# Altium project EMS_Bus.PrjPcb
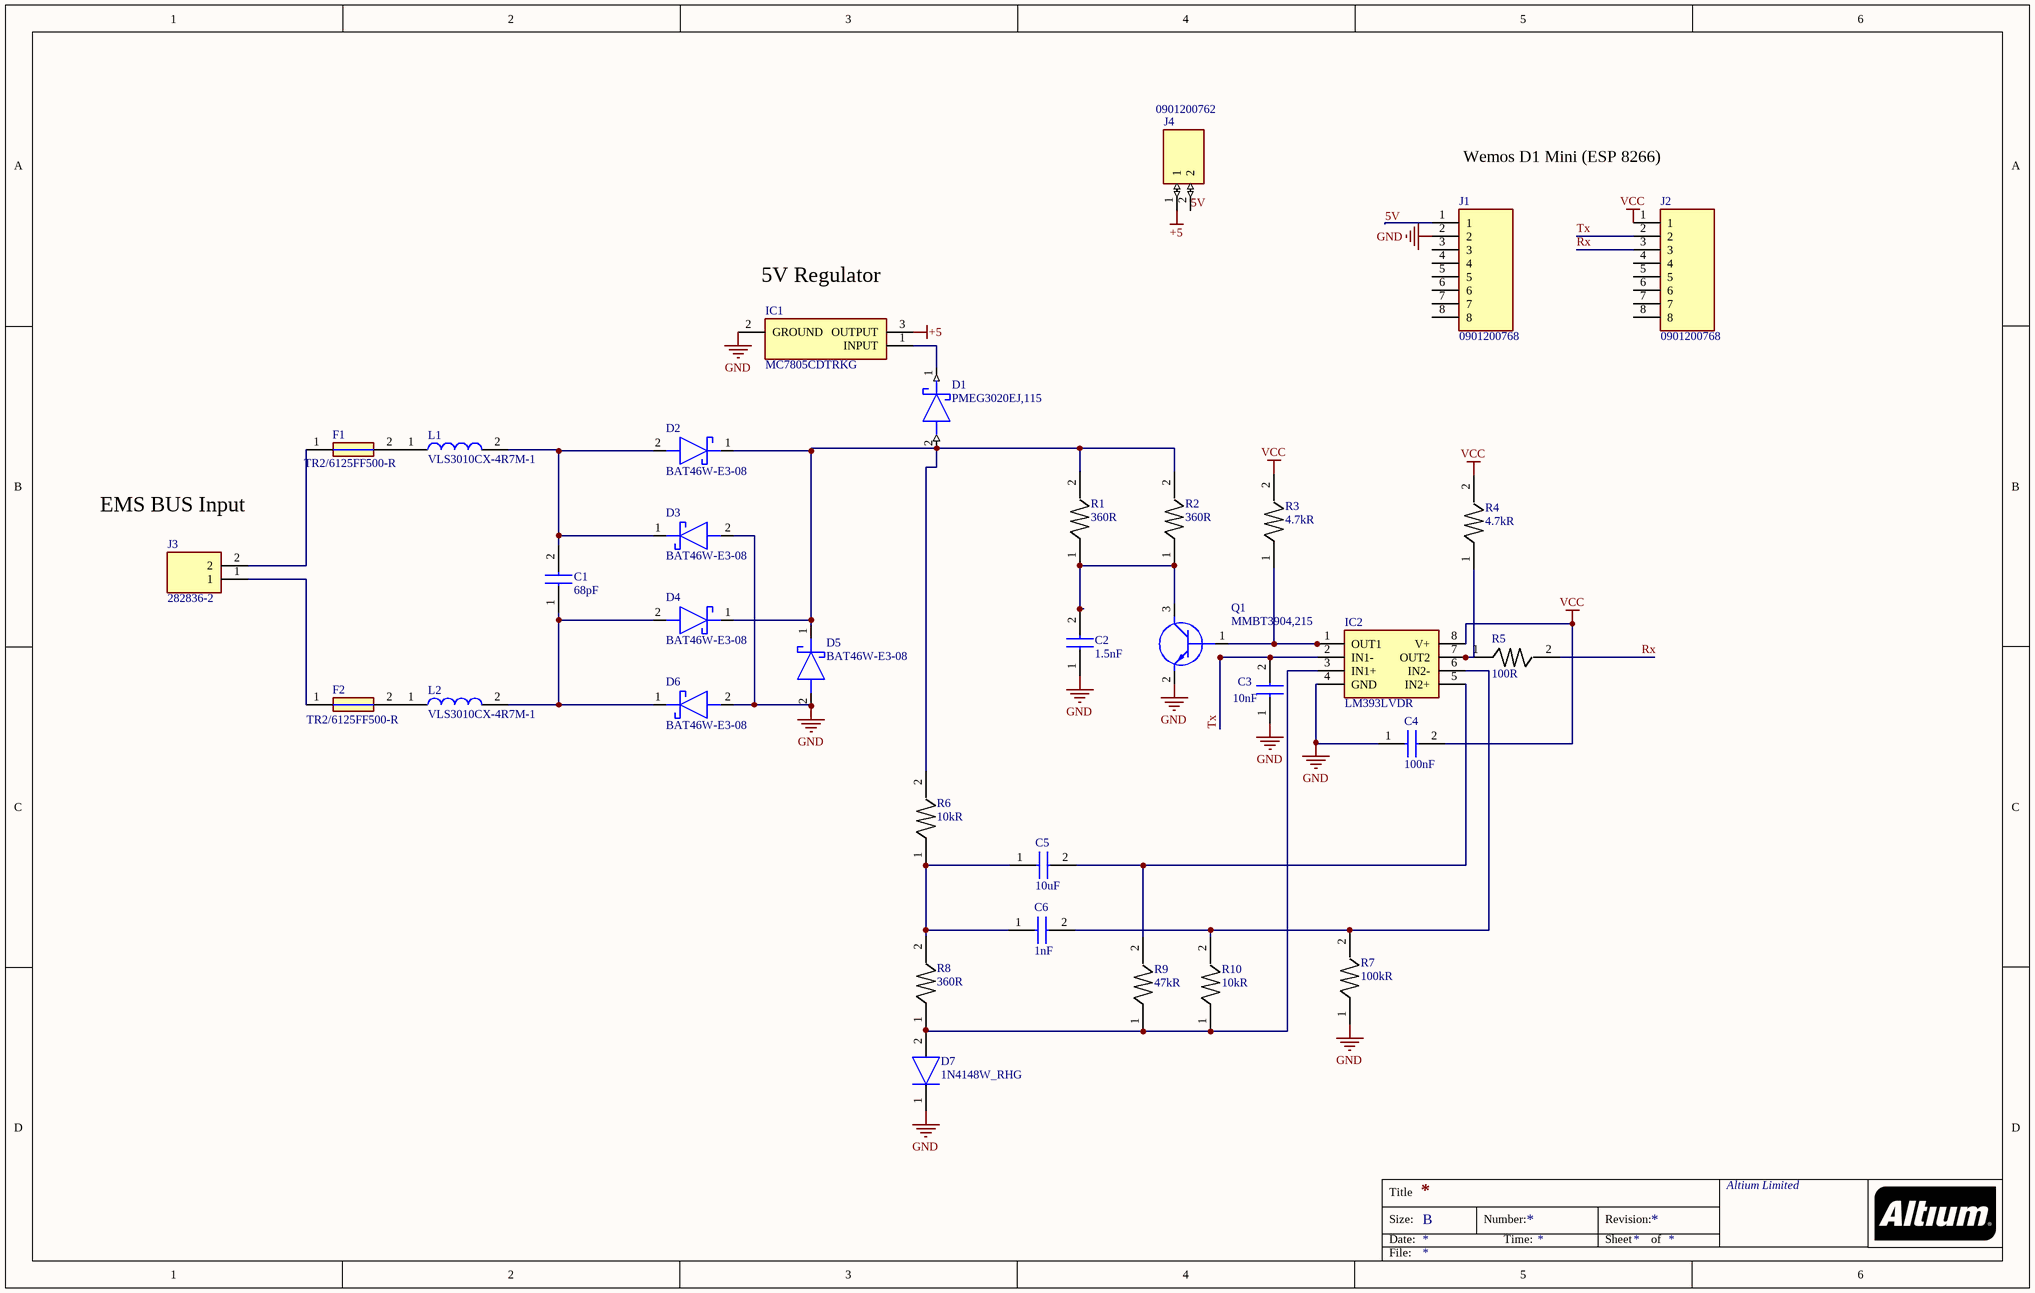
[diagram p0: EMS_Bus.SchDoc]
1 sheet, 34 parts. Net scope: global (net labels, ports and power ports of the same name join across sheets).
Board file: EMS_Bus.PcbDoc

## Sheet EMS_Bus.SchDoc
size B; Organization: Altium Limited; PageSetup: Record=PageOptions|CenterHorizontal=True|CenterVertical=True|PrintScale=1.09|XCorrection=1.00|YCorrection=1.00|PrintKind=0|BorderSize=5000000|LeftOffset=0|BottomOffset=0|Orientation=2|PaperLength=4318|PaperWidth=2794|Scale=100|PaperSource=7|PrintQuality=600|MediaType=1|DitherType=10|PaperKind=11" x 17"|PrintScaleMode=1

### Parts
C1  Capacitance: 68pF  [CAPC2012X70N]  (hidden comment: 885012007056)
C2  Capacitance: 1.5nF  [CAPC2012X90N]  (hidden comment: 885012207087)
C3  Capacitance: 10nF  [CAPC2012X90N]  (hidden comment: 885012207092)
C4  Capacitance: 100nF  [CAPC2012X90N]  (hidden comment: 885012207098)
C5  Capacitance: 10uF  [CAPC2012X135N]  (hidden comment: 885012107014)
C6  Capacitance: 1nF  [CAPC2012X90N]  (hidden comment: 885012007063)
D1  PMEG3020EJ,115  [SODFL2512X80N]
D2  BAT46W-E3-08  [SOD3716X135N]
D3  BAT46W-E3-08  [SOD3716X135N]
D4  BAT46W-E3-08  [SOD3716X135N]
D5  BAT46W-E3-08  [SOD3716X135N]
D6  BAT46W-E3-08  [SOD3716X135N]
D7  1N4148W_RHG  [1N4148WRHG]
F1  Manufacturer Part Number: TR2/6125FF500-R  [FUSC6127X287N]  (hidden comment: TR2_6125FF500-R)
F2  Manufacturer Part Number: TR2/6125FF500-R  [FUSC6127X287N]  (hidden comment: TR2_6125FF500-R)
IC1  MC7805CDTRKG  [MJD1221G]
IC2  LM393LVDR  [SOIC127P600X175-8N]
J1  0901200768  [HDRV8W65P0X254_1X8_2010X249X560P]
J2  0901200768  [HDRV8W65P0X254_1X8_2010X249X560P]
J3  282836-2  [2828362]
J4  0901200762  [HDRV2W65P0X254_1X2_508X254X925P]
L1  VLS3010CX-4R7M-1  [INDPM3030X100N]
L2  VLS3010CX-4R7M-1  [INDPM3030X100N]
Q1  MMBT3904,215  [SOT95P230X110-3N]
R1  Resistance: 360R  [RESC2012X60N]  (hidden comment: RC0805FR-07360RL)
R2  Resistance: 360R  [RESC2012X60N]  (hidden comment: RC0805FR-07360RL)
R3  Resistance: 4.7kR  [RESC2012X60N]  (hidden comment: RC0805FR-074K7L)
R4  Resistance: 4.7kR  [RESC2012X60N]  (hidden comment: RC0805FR-074K7L)
R5  Resistance: 100R  [RESC2012X60N]  (hidden comment: RC0805FR-07100RL)
R6  Resistance: 10kR  [RESC2012X60N]  (hidden comment: RT0805FRE0710KL)
R7  Resistance: 100kR  [RESC2012X60N]  (hidden comment: RC0805FR-07100KL)
R8  Resistance: 360R  [RESC2012X60N]  (hidden comment: RC0805FR-07360RL)
R9  Resistance: 47kR  [RESC2012X60N]  (hidden comment: RT0805FRE0747KL)
R10  Resistance: 10kR  [RESC2012X60N]  (hidden comment: RT0805FRE0710KL)

### Nets
+5: IC1.3(OUTPUT) J4.1
GND: C2.1 C3.1 C4.1 D3.2(A) D5.2(A) D6.2(A) D7.1(K) IC1.2(GROUND) IC2.4(GND) J1.2 Q1.2(E) R7.1
VCC: C4.2 IC2.8(V+) J2.1 R3.2 R4.2
5V: J1.1 J4.2
Rx: J2.3 R5.2
Tx: C3.2 IC2.2(IN1-) J2.2
NetC1_1: C1.1 D4.2(A) D6.1(K) L2.2
NetC1_2: C1.2 D2.2(A) D3.1(K) L1.2
NetC2_2: C2.2 Q1.3(C) R1.1 R2.1
NetC5_1: C5.1 C6.1 R6.1 R8.2
NetC5_2: C5.2 IC2.5(IN2+) R9.2
NetC6_2: C6.2 IC2.6(IN2-) R7.2 R10.2
NetD1_1: D1.1(K) IC1.1(INPUT)
NetD1_2: D1.2(A) D2.1(K) D4.1(K) D5.1(K) R1.2 R2.2 R6.2
NetD7_2: D7.2(A) IC2.3(IN1+) R8.1 R9.1 R10.1
NetF1_1: F1.1 J3.2
NetF1_2: F1.2 L1.1
NetF2_1: F2.1 J3.1
NetF2_2: F2.2 L2.1
NetIC2_1: IC2.1(OUT1) Q1.1(B) R3.1
NetIC2_7: IC2.7(OUT2) R4.1 R5.1

Not connected (* = marked no-connect by the designer): J1 3 4 5 6 7 8; J2 4 5 6 7 8

### Notes on the sheet
- Wemos D1 Mini (ESP 8266)
- (near IC1) 5V Regulator
- (near J3) EMS BUS Input
- Title
- Size:
- Date:
- B
- Number:
- Time:
- Revision:
- Sheet
- of
- File:

### Library data of the parts
C1 = 885012007056: Capacitor; Manufacturer_Name: Wurth Elektronik; Manufacturer: Wurth Electronics; Voltage Rating: 50V; Tolerance: 5%; Dielectric: X5R; Voltage Rating (DC): 16V; Datasheet Link: https://katalog.we-online.com/pbs/datasheet/885012007056.pdf; Height: 0.7mm; Manufacturer_Part_Number: 885012007056; Supplier 1: Digi-Key; Manufacturer Part Number: 885012007056; Stock 1: 6195; Pricing 1: 1=0.10000, 10=0.04900, 100=0.04410, 500=0.03900 (USD); RoHS: Yes; Mount: Surface Mount; Case/Package: 0805; Case Code (Metric): 2012; Case Code (Imperial): 0805; Min Operating Temperature: -55°C; Max Operating Temperature: 125°C; Packaging: Tape and Reel; Length: 0.079inch; Width: 0.049inch; Thickness: 0.028inch; RoHS Compliant: Yes; ComponentLink1URL: https://katalog.we-online.de/pbs/datasheet/885012007056.pdf?src-supplier=Digi-Key; ComponentLink1Description: https://katalog.we-online.de/pbs/datasheet/885012007056.pdf?src-supplier=Digi-Key; Supplier 2: Digi-Key; Stock 2: 4701; Pricing 2: 1=0.10000, 10=0.05900, 100=0.05310, 500=0.04698 (USD); ComponentLink2URL: https://katalog.we-online.de/pbs/datasheet/885012007063.pdf?src-supplier=Digi-Key; ComponentLink2Description: https://katalog.we-online.de/pbs/datasheet/885012007063.pdf?src-supplier=Digi-Key; Supplier 3: Digi-Key; Stock 3: 926; Pricing 3: 1=0.28000, 10=0.25600, 100=0.22990, 500=0.20334, 1000=0.13000 (USD); REACH SVHC: Unknown; ComponentLink3URL: http://www.farnell.com/datasheets/1958454.pdf?src-supplier=Farnell; ComponentLink3Description: http://www.farnell.com/datasheets/1958454.pdf?src-supplier=Farnell; ComponentLink4URL: http://www.farnell.com/datasheets/1958454.pdf?src-supplier=Element14; ComponentLink4Description: http://www.farnell.com/datasheets/1958454.pdf?src-supplier=Element14; ComponentLink5URL: https://katalog.we-online.de/pbs/datasheet/885012107014.pdf?src-supplier=Digi-Key; ComponentLink5Description: https://katalog.we-online.de/pbs/datasheet/885012107014.pdf?src-supplier=Digi-Key; ComponentLink6URL: http://www.farnell.com/datasheets/1958454.pdf?src-supplier=Newark; ComponentLink6Description: http://www.farnell.com/datasheets/1958454.pdf?src-supplier=Newark
C2 = 885012207087: Capacitor; Manufacturer_Name: Wurth Elektronik; Manufacturer: Wurth Electronics; Voltage Rating: 50V; Tolerance: 10%; Datasheet Link: https://katalog.we-online.com/pbs/datasheet/885012207087.pdf; Height: 0.9mm; Manufacturer_Part_Number: 885012207087; Mouser Part Number: 710-885012207087; Mouser Price/Stock: https://www.mouser.co.uk/ProductDetail/Wurth-Elektronik/885012207087/?qs=0KOYDY2FL29zqUuVSiTMTA%3D%3D; Supplier 1: Digi-Key; Manufacturer Part Number: 885012207087; Stock 1: 3440; Pricing 1: 1=0.10000, 10=0.03400, 100=0.03070, 500=0.02716 (USD); RoHS: Yes; Mount: Surface Mount; Case/Package: 0805; Case Code (Metric): 2012; Case Code (Imperial): 0805; Min Operating Temperature: -55°C; Max Operating Temperature: 125°C; Packaging: Tape and Reel; Length: 0.079inch; Width: 0.049inch; Thickness: 0.035inch; RoHS Compliant: Yes; ComponentLink1URL: https://katalog.we-online.de/pbs/datasheet/885012207087.pdf?src-supplier=Digi-Key; ComponentLink1Description: https://katalog.we-online.de/pbs/datasheet/885012207087.pdf?src-supplier=Digi-Key; Supplier Part Number 1: 732-8069-1-ND
C3 = 885012207092: Capacitor; Manufacturer_Name: Wurth Elektronik; Manufacturer: Wurth Electronics; Voltage Rating: 50V; Dielectric: X7R; Tolerance: 10%; Datasheet Link: https://katalog.we-online.com/pbs/datasheet/885012207092.pdf; Height: 0.9mm; Manufacturer_Part_Number: 885012207092; Mouser Part Number: 710-885012207092; Mouser Price/Stock: https://www.mouser.com/Search/Refine.aspx?Keyword=710-885012207092; Supplier 1: Digi-Key; Manufacturer Part Number: 885012207092; Stock 1: 15219; Pricing 1: 1=0.10000, 10=0.03400, 100=0.03070, 500=0.02714 (USD); RoHS: Yes; Mount: Surface Mount; Case/Package: 0805; Case Code (Metric): 2012; Case Code (Imperial): 0805; Min Operating Temperature: -55°C; Max Operating Temperature: 125°C; Packaging: Cut Tape; Voltage Rating (DC): 50V; Length: 0.079inch; Width: 0.049inch; Thickness: 0.035inch; REACH SVHC: Unknown; RoHS Compliant: Yes; ComponentLink1URL: http://www.farnell.com/datasheets/1958497.pdf?src-supplier=Farnell; ComponentLink1Description: http://www.farnell.com/datasheets/1958497.pdf?src-supplier=Farnell; ComponentLink2URL: http://www.farnell.com/datasheets/1958497.pdf?src-supplier=Newark; ComponentLink2Description: http://www.farnell.com/datasheets/1958497.pdf?src-supplier=Newark; ComponentLink3URL: https://katalog.we-online.de/pbs/datasheet/885012207092.pdf?src-supplier=Digi-Key; ComponentLink3Description: https://katalog.we-online.de/pbs/datasheet/885012207092.pdf?src-supplier=Digi-Key; ComponentLink4URL: http://www.farnell.com/datasheets/1958497.pdf?src-supplier=Element14; ComponentLink4Description: http://www.farnell.com/datasheets/1958497.pdf?src-supplier=Element14; Supplier Part Number 1: 732-8074-1-ND
C4 = 885012207098: Capacitor; Manufacturer_Name: Wurth Elektronik; Manufacturer: Wurth Electronics; Voltage Rating: 50V; Dielectric: X7R; Tolerance: 10%; Datasheet Link: https://katalog.we-online.com/pbs/datasheet/885012207098.pdf; Height: 0.9mm; Manufacturer_Part_Number: 885012207098; Mouser Part Number: 710-885012207098; Mouser Price/Stock: https://www.mouser.co.uk/ProductDetail/Wurth-Elektronik/885012207098?qs=0KOYDY2FL29sZCNyRsrK9g%3D%3D; Supplier 1: Digi-Key; Manufacturer Part Number: 885012207098; Stock 1: 65365; Pricing 1: 1=0.10000, 10=0.07400, 100=0.06640, 500=0.05878, 1000=0.03577 (USD); RoHS: Yes; Mount: Surface Mount; Case/Package: 0805; Case Code (Metric): 2012; Case Code (Imperial): 0805; Min Operating Temperature: -55°C; Max Operating Temperature: 125°C; Packaging: Cut Tape; Voltage Rating (DC): 50V; Length: 0.079inch; Width: 0.049inch; Thickness: 0.035inch; REACH SVHC: Unknown; RoHS Compliant: Yes; ComponentLink1URL: http://www.farnell.com/datasheets/1958498.pdf?src-supplier=Farnell; ComponentLink1Description: http://www.farnell.com/datasheets/1958498.pdf?src-supplier=Farnell; ComponentLink2URL: http://www.farnell.com/datasheets/1958498.pdf?src-supplier=Element14; ComponentLink2Description: http://www.farnell.com/datasheets/1958498.pdf?src-supplier=Element14; ComponentLink3URL: http://www.farnell.com/datasheets/1958498.pdf?src-supplier=Newark; ComponentLink3Description: http://www.farnell.com/datasheets/1958498.pdf?src-supplier=Newark; ComponentLink4URL: https://katalog.we-online.de/pbs/datasheet/885012207098.pdf?src-supplier=Digi-Key; ComponentLink4Description: https://katalog.we-online.de/pbs/datasheet/885012207098.pdf?src-supplier=Digi-Key; Supplier Part Number 1: 732-8080-1-ND
C5 = 885012107014: Capacitor; Manufacturer_Name: Wurth Elektronik; Manufacturer: Wurth Electronics; Voltage Rating: 16V; Dielectric: X5R; Tolerance: 20%; Datasheet Link: https://katalog.we-online.com/pbs/datasheet/885012107014.pdf; Height: 1.35mm; Manufacturer_Part_Number: 885012107014; Mouser Part Number: 710-885012107014; Mouser Price/Stock: https://www.mouser.co.uk/ProductDetail/Wurth-Elektronik/885012107014/?qs=0KOYDY2FL28i0pwNdARIlg%3D%3D; Supplier 1: Digi-Key; Manufacturer Part Number: 885012107014; Stock 1: 926; Pricing 1: 1=0.28000, 10=0.25600, 100=0.22990, 500=0.20334, 1000=0.13000 (USD); RoHS: Yes; Mount: Surface Mount; Case/Package: 0805; Case Code (Metric): 2012; Case Code (Imperial): 0805; Min Operating Temperature: -55°C; Max Operating Temperature: 85°C; Packaging: Cut Tape; Voltage Rating (DC): 16V; Length: 0.079inch; Width: 0.049inch; Thickness: 0.057inch; REACH SVHC: Unknown; RoHS Compliant: Yes; ComponentLink1URL: http://www.farnell.com/datasheets/1958454.pdf?src-supplier=Farnell; ComponentLink1Description: http://www.farnell.com/datasheets/1958454.pdf?src-supplier=Farnell; ComponentLink2URL: http://www.farnell.com/datasheets/1958454.pdf?src-supplier=Element14; ComponentLink2Description: http://www.farnell.com/datasheets/1958454.pdf?src-supplier=Element14; ComponentLink3URL: https://katalog.we-online.de/pbs/datasheet/885012107014.pdf?src-supplier=Digi-Key; ComponentLink3Description: https://katalog.we-online.de/pbs/datasheet/885012107014.pdf?src-supplier=Digi-Key; ComponentLink4URL: http://www.farnell.com/datasheets/1958454.pdf?src-supplier=Newark; ComponentLink4Description: http://www.farnell.com/datasheets/1958454.pdf?src-supplier=Newark; Supplier 2: Digi-Key; Stock 2: 926; Pricing 2: 1=0.28000, 10=0.25600, 100=0.22990, 500=0.20334, 1000=0.13000 (USD); Supplier 3: Mouser; Stock 3: 6658; Pricing 3: 1=0.29000, 10=0.25700, 50=0.25700, 100=0.23000, 1000=0.20400, 10000=0.17700 (USD)
C6 = 885012007063: Capacitor; Manufacturer_Name: Wurth Elektronik; Manufacturer: Wurth Electronics; Voltage Rating: 50V; Tolerance: 5%; Datasheet Link: https://katalog.we-online.com/pbs/datasheet/885012007063.pdf; Height: 0.9mm; Manufacturer_Part_Number: 885012007063; Mouser Part Number: 710-885012007063; Mouser Price/Stock: https://www.mouser.com/Search/Refine.aspx?Keyword=710-885012007063; Supplier 1: Digi-Key; Manufacturer Part Number: 885012007063; Stock 1: 4701; Pricing 1: 1=0.10000, 10=0.05900, 100=0.05310, 500=0.04698 (USD); RoHS: Yes; Mount: Surface Mount; Case/Package: 0805; Case Code (Metric): 2012; Case Code (Imperial): 0805; Min Operating Temperature: -55°C; Max Operating Temperature: 125°C; Packaging: Tape and Reel; Length: 0.079inch; Width: 0.049inch; Thickness: 0.035inch; RoHS Compliant: Yes; ComponentLink1URL: https://katalog.we-online.de/pbs/datasheet/885012007063.pdf?src-supplier=Digi-Key; ComponentLink1Description: https://katalog.we-online.de/pbs/datasheet/885012007063.pdf?src-supplier=Digi-Key; Supplier Part Number 1: 732-7858-1-ND
D1 = PMEG3020EJ,115: Schottky Diode; Manufacturer_Name: Nexperia; Datasheet Link: http://uk.rs-online.com/web/p/products/1242390; Height: 0.8mm; Manufacturer_Part_Number: PMEG3020EJ,115; Mouser Part Number: 771-PMEG3020EJ-T/R; Mouser Price/Stock: https://www.mouser.co.uk/ProductDetail/Nexperia/PMEG3020EJ115/?qs=LOCUfHb8d9uQQHu%2Fcy97QQ%3D%3D; Arrow Part Number: PMEG3020EJ,115; Arrow Price/Stock: https://www.arrow.com/en/products/pmeg3020ej115/nexperia
D2-D6 = BAT46W-E3-08: Schottky Diode; Manufacturer_Name: Vishay; Datasheet Link: https://www.vishay.com/docs/85663/bat46wv.pdf; Height: 1.35mm; Manufacturer_Part_Number: BAT46W-E3-08; Mouser Part Number: 78-BAT46W-E3-08; Mouser Price/Stock: https://www.mouser.co.uk/ProductDetail/Vishay-Semiconductors/BAT46W-E3-08/?qs=KP8Io%2FXyE5QAjvoG5XlHWA%3D%3D; Arrow Part Number: BAT46W-E3-08; Arrow Price/Stock: https://www.arrow.com/en/products/bat46w-e3-08/vishay; Supplier 1: Digi-Key; Supplier Part Number 1: BAT46W-E3-08CT-ND
D7 = 1N4148W_RHG: Diode; Manufacturer_Name: Taiwan Semiconductor; Manufacturer_Part_Number: 1N4148W RHG; Datasheet Link: https://mouser.componentsearchengine.com/Datasheets/1/1N4148W RHG.pdf; Height: 1.15mm; Mouser Part Number: 821-1N4148WRHG; Mouser Price/Stock: https://www.mouser.co.uk/ProductDetail/Taiwan-Semiconductor/1N4148W-RHG?qs=KwaGCOX4wIag2YPLXylAvA%3D%3D; Arrow Part Number: 1N4148W RHG; Arrow Price/Stock: https://www.arrow.com/en/products/1n4148wrhg/taiwan-semiconductor
F1 F2 = TR2_6125FF500-R: Fuse; Manufacturer_Name: Eaton; Manufacturer: Eaton Bussmann; Current Rating: 500mA; Max Voltage Rating (DC): 72V; Voltage Rating (AC): 125V; Resistance: 750mR; Fuse Type: Board Mount (Cartridge Style Excluded); Approvals: cULus; Datasheet Link: https://componentsearchengine.com/Datasheets/1/TR2_6125FF500-R.pdf; Height: 2.87mm; Manufacturer_Part_Number: TR2/6125FF500-R; Mouser Part Number: 504-TR2/6125FF500-R; Mouser Price/Stock: https://www.mouser.com/Search/Refine.aspx?Keyword=504-TR2%2F6125FF500-R; Supplier 1: Digi-Key; Stock 1: 4568; Pricing 1: 1=0.78000, 5=0.75800, 10=0.73400, 50=0.61740, 100=0.51260, 250=0.46600, 500=0.39610, 1000=0.34950 (USD); RoHS: Yes; Mount: Surface Mount; Case/Package: SMD/SMT; Number of Pins: 2; Weight: 0.032oz; Min Operating Temperature: -55°C; Voltage Rating (DC): 72V; Packaging: Tape and Reel; Package Quantity: 5000; Max Voltage Rating (AC): 125V; Fuse Current: 500mA; Series: 6125FF; DC Cold Resistance: 750mR; Length: 6.1mm; Width: 2.72mm; Depth: 2.72mm; Radiation Hardening: No; REACH SVHC: No SVHC; RoHS Compliant: Yes; ComponentLink1URL: https://datasheet.ciiva.com/8073/0851f98e-1dec-44f8-815f-387ec7fe1210-8073990.pdf?src-supplier=Element14; ComponentLink1Description: https://datasheet.ciiva.com/8073/0851f98e-1dec-44f8-815f-387ec7fe1210-8073990.pdf?src-supplier=Element14; Supplier Part Number 1: 283-2952-1-ND
IC1 = MC7805CDTRKG: Integrated Circuit; Manufacturer_Name: ON Semiconductor; Max Input Voltage: 35V; Min Input Voltage: 10V; Output Current: 1A; Nominal Output Voltage: 5V; Dropout Voltage: 2V; Number of Outputs: 1; Polarity: Positive; Quiescent Current: 3.2mA; Max Output Voltage: 5.2V; Output Voltage Accuracy: 4%; Power Supply Rejection Ratio (PSRR): 83dB; Output Type: Fixed; Datasheet Link: https://datasheet.lcsc.com/szlcsc/ON-Semicon-ON-MC7805CDTRKG_C54285.pdf; Height: 2.38mm; Manufacturer_Part_Number: MC7805CDTRKG; Mouser Part Number: 863-MC7805CDTRKG; Mouser Price/Stock: https://www.mouser.co.uk/ProductDetail/ON-Semiconductor/MC7805CDTRKG/?qs=%252B9%2Fcbd0IE0RZ%252B1%252BvH1A5MQ%3D%3D; Arrow Part Number: MC7805CDTRKG; Arrow Price/Stock: https://www.arrow.com/en/products/mc7805cdtrkg/on-semiconductor; Supplier 1: Digi-Key; Manufacturer: ON Semiconductor; Manufacturer Part Number: MC7805CDTRKG; Stock 1: 14176; Pricing 1: 1=0.56000, 10=0.47800, 25=0.44600, 100=0.33130, 250=0.28032, 500=0.26756, 1000=0.19749 (USD); RoHS: Yes; Mount: Surface Mount; Case/Package: DPAK; Number of Pins: 3; Contact Plating: Tin,Matte; Min Operating Temperature: 0°C; Max Operating Temperature: 125°C; Packaging: Tape and Reel; Package Quantity: 1; Max Output Current: 1A; Output Voltage: 5V; Number of Regulators: 1; Min Output Voltage: 5V; Accuracy: 4%; Length: 6.73mm; Width: 6.22mm; Radiation Hardening: No; REACH SVHC: No SVHC; Lead Free: Lead Free; Halogen Free: Halogen Free; RoHS Compliant: Yes; ComponentLink1URL: https://datasheet.ciiva.com/1643/mc7800-d-1643648.pdf?src-supplier=Newark; ComponentLink1Description: https://datasheet.ciiva.com/1643/mc7800-d-1643648.pdf?src-supplier=Newark; ComponentLink2URL: https://datasheet.ciiva.com/2042/mc7800-d-2042320.pdf?src-supplier=Digi-Key; ComponentLink2Description: https://datasheet.ciiva.com/2042/mc7800-d-2042320.pdf?src-supplier=Digi-Key; ComponentLink3URL: https://datasheet.ciiva.com/2042/mc7800-d-2042318.pdf?src-supplier=Digi-Key; ComponentLink3Description: https://datasheet.ciiva.com/2042/mc7800-d-2042318.pdf?src-supplier=Digi-Key; ComponentLink4URL: https://datasheet.ciiva.com/8229/mc7800-d-8229966.pdf?src-supplier=Avnet; ComponentLink4Description: https://datasheet.ciiva.com/8229/mc7800-d-8229966.pdf?src-supplier=Avnet; ComponentLink5URL: https://datasheet.ciiva.com/8234/mc7800-d-8234046.pdf?src-supplier=Avnet; ComponentLink5Description: https://datasheet.ciiva.com/8234/mc7800-d-8234046.pdf?src-supplier=Avnet; ComponentLink6URL: https://datasheet.ciiva.com/2042/mc7800-d-2042319.pdf?src-supplier=Digi-Key; ComponentLink6Description: https://datasheet.ciiva.com/2042/mc7800-d-2042319.pdf?src-supplier=Digi-Key; Supplier Part Number 1: MC7805CDTRKGOSCT-ND
IC2 = LM393LVDR: Integrated Circuit; Manufacturer_Name: Texas Instruments; Datasheet Link: https://www.ti.com/lit/ds/symlink/lm393lv.pdf?ts=1609509320428&ref_url=https%253A%252F%252Feu.mouser.com%252F; Height: 1.75mm; Manufacturer_Part_Number: LM393LVDR; Mouser Part Number: 595-LM393LVDR; Mouser Price/Stock: https://www.mouser.co.uk/ProductDetail/Texas-Instruments/LM393LVDR/?qs=zW32dvEIR3vk5%2FzEI25KTQ%3D%3D; Arrow Part Number: LM393LVDR; Arrow Price/Stock: https://www.arrow.com/en/products/lm393lvdr/texas-instruments; Supplier 1: Digi-Key; Manufacturer: Texas Instruments; Manufacturer Part Number: LM393LVDR; Stock 1: 1138; Pricing 1: 1=0.42000, 10=0.35800, 25=0.33400, 100=0.24800, 250=0.20988, 500=0.20034, 1000=0.14787 (USD); RoHS: No; Supplier Part Number 1: 296-LM393LVDRCT-ND
J1 J2 = 0901200768: Connector; Manufacturer_Name: Molex; Datasheet Link: https://www.molex.com/pdm_docs/sd/901200768_sd.pdf; Height: 5.6mm; Manufacturer_Part_Number: 0901200768; Arrow Part Number: 0901200768; Arrow Price/Stock: https://www.arrow.com/en/products/0901200768/molex
J3 = 282836-2: Connector; Manufacturer_Name: TE Connectivity; Datasheet Link: https://www.te.com/commerce/DocumentDelivery/DDEController?Action=showdoc&DocId=Customer+Drawing%7F282836%7FJ%7Fpdf%7FEnglish%7FENG_CD_282836_J.pdf%7F282836-2; Height: 10mm; Manufacturer_Part_Number: 282836-2; Mouser Part Number: 571-2828362; Mouser Price/Stock: https://www.mouser.co.uk/ProductDetail/TE-Connectivity/282836-2/?qs=A%252Bip%252BNCYi6Ohx9vaQ1l4dg%3D%3D; Arrow Part Number: 282836-2; Arrow Price/Stock: https://www.arrow.com/en/products/282836-2/te-connectivity
J4 = 0901200762: Connector; Manufacturer_Name: Molex; Datasheet Link: https://www.molex.com/pdm_docs/sd/901200761_sd.pdf; Height: 9.25mm; Manufacturer_Part_Number: 0901200762; Mouser Part Number: N/A; Mouser Price/Stock: https://www.mouser.com/Search/Refine.aspx?Keyword=N%2FA; Arrow Part Number: 0901200762; Arrow Price/Stock: https://www.arrow.com/en/products/0901200762/molex
L1 L2 = VLS3010CX-4R7M-1: Inductor; Manufacturer_Name: TDK; Datasheet Link: https://product.tdk.com/en/search/inductor/inductor/smd/info?part_no=VLS3010CX-2R2M-1; Height: 1mm; Manufacturer_Part_Number: VLS3010CX-4R7M-1; Mouser Part Number: 810-VLS3010CX-4R7M-1; Mouser Price/Stock: https://www.mouser.co.uk/ProductDetail/TDK/VLS3010CX-4R7M-1/?qs=B6kkDfuK7%2FBGNQNlQF7fxQ%3D%3D; Supplier 1: Digi-Key; Manufacturer: TDK; Manufacturer Part Number: VLS3010CX-4R7M-1; Stock 1: 0; RoHS: No; Supplier Part Number 1: 445-VLS3010CX-4R7M-1CT-ND
Q1 = MMBT3904,215: Transistor BJT NPN; Manufacturer_Name: Nexperia; Datasheet Link: http://assets.nexperia.com/documents/data-sheet/MMBT3904.pdf; Height: 1.1mm; Manufacturer_Part_Number: MMBT3904,215; Mouser Part Number: 771-MMBT3904T/R; Mouser Price/Stock: https://www.mouser.co.uk/ProductDetail/Nexperia/MMBT3904215/?qs=LOCUfHb8d9s%2FW6hzAJGDbw%3D%3D; Arrow Part Number: MMBT3904,215; Arrow Price/Stock: https://www.arrow.com/en/products/mmbt3904215/nexperia; Supplier 1: Digi-Key; Manufacturer: Nexperia; Manufacturer Part Number: MMBT3904,215; Stock 1: 211278; Pricing 1: 1=0.10000, 10=0.06500, 25=0.06200, 100=0.03500, 500=0.02750, 1000=0.01910 (USD); RoHS: Yes; RoHS Compliant: Yes; ComponentLink1URL: http://www.farnell.com/datasheets/2328888.pdf?src-supplier=Farnell; ComponentLink1Description: http://www.farnell.com/datasheets/2328888.pdf?src-supplier=Farnell; ComponentLink2URL: https://assets.nexperia.com/documents/data-sheet/MMBT3904.pdf?src-supplier=Digi-Key; ComponentLink2Description: https://assets.nexperia.com/documents/data-sheet/MMBT3904.pdf?src-supplier=Digi-Key; ComponentLink3URL: http://www.farnell.com/datasheets/2328888.pdf?src-supplier=Newark; ComponentLink3Description: http://www.farnell.com/datasheets/2328888.pdf?src-supplier=Newark; Supplier Part Number 1: 1727-4044-1-ND
R1 R2 R8 = RC0805FR-07360RL: Resistor; Manufacturer_Name: YAGEO (PHYCOMP); Manufacturer: Yageo; Tolerance: 1%; Power Rating: 125mW; Voltage Rating: 150V; Temperature Coefficient: 100ppm/°C; Datasheet Link: http://www.yageo.com/documents/recent/PYu-RC_Group_51_RoHS_L_10.pdf; Height: 0.6mm; Manufacturer_Part_Number: RC0805FR-07360RL; Mouser Part Number: 603-RC0805FR-07360RL; Mouser Price/Stock: https://www.mouser.co.uk/ProductDetail/Yageo/RC0805FR-07360RL?qs=g6xwsc4j%252B%2FrtiMosZ5jFWw%3D%3D; Supplier 1: Digi-Key; Manufacturer Part Number: RC0805FR-07360RL; Stock 1: 187; Pricing 1: 1=0.10000, 10=0.04000, 100=0.01620, 1000=0.00726, 2500=0.00630 (USD); RoHS: Yes; Mount: Surface Mount; Case/Package: 0805; Case Code (Imperial): 0805; Case Code (Metric): 2012; Size Code: 0805; Min Operating Temperature: -55°C; Max Operating Temperature: 155°C; Packaging: Tape and Reel; Termination: SMD/SMT; Voltage Rating (DC): 150V; Features: Moisture Resistant; Series: RC; Max Power Dissipation: 125mW; Number of Terminations: 2; Technology: THICK FILM; Length: 2mm; Depth: 1.25mm; Lead Free: Lead Free; RoHS Compliant: Yes; ComponentLink1URL: https://datasheet.ciiva.com/11808/0900766b8106beab-11808261.pdf?src-supplier=RSComponents; ComponentLink1Description: https://datasheet.ciiva.com/11808/0900766b8106beab-11808261.pdf?src-supplier=RSComponents; ComponentLink2URL: https://datasheet.ciiva.com/12667/rc0805-12667401.pdf?src-supplier=Mouser; ComponentLink2Description: https://datasheet.ciiva.com/12667/rc0805-12667401.pdf?src-supplier=Mouser; ComponentLink3URL: https://datasheet.ciiva.com/17423/rc0805-17423149.pdf?src-supplier=Future+Electronics; ComponentLink3Description: https://datasheet.ciiva.com/17423/rc0805-17423149.pdf?src-supplier=Future+Electronics; Supplier Part Number 1: 311-360CRCT-ND
R3 R4 = RC0805FR-074K7L: Resistor; Manufacturer_Name: YAGEO (PHYCOMP); Manufacturer: Yageo; Tolerance: 1%; Temperature Coefficient: 100ppm/°C; Voltage Rating (DC): 150V; Power Rating: 125mW; Datasheet Link: http://www.yageo.com/documents/recent/PYu-RC_Group_51_RoHS_L_10.pdf; Height: 0.6mm; Manufacturer_Part_Number: RC0805FR-074K7L; Mouser Part Number: 603-RC0805FR-074K7L; Mouser Price/Stock: https://www.mouser.co.uk/ProductDetail/Yageo/RC0805FR-074K7L?qs=VLOqbHBAO5cYXbrd7RTmuQ%3D%3D; Arrow Part Number: RC0805FR-074K7L; Arrow Price/Stock: https://www.arrow.com/en/products/rc0805fr-074k7l/yageo; Supplier 1: Digi-Key; Manufacturer Part Number: RC0805FR-074K7L; Stock 1: 978989; Pricing 1: 1=0.10000, 10=0.04000, 100=0.01620, 1000=0.00726, 2500=0.00630 (USD); RoHS: Yes; Case/Package: 0805; Number of Pins: 2; Case Code (Metric): 2012; Case Code (Imperial): 0805; Size Code: 0805; Min Operating Temperature: -55°C; Max Operating Temperature: 155°C; Resistor Type: Thick Film; Packaging: Tape and Reel; Package Quantity: 5000; Voltage Rating: 150V; Number of Terminations: 2; Termination: SMD/SMT; Max Power Dissipation: 125mW; Features: Moisture Resistant; Series: RC; Resistance Tolerance: 1%; Technology: THICK FILM; Construction: Rectangular; Length: 0.079inch; Width: 0.049inch; Depth: 1.25mm; REACH SVHC: No SVHC; Lead Free: Lead Free; RoHS Compliant: Yes; Military Standard: Not; ComponentLink1URL: https://datasheet.ciiva.com/11808/0900766b8106beab-11808155.pdf?src-supplier=RSComponents; ComponentLink1Description: https://datasheet.ciiva.com/11808/0900766b8106beab-11808155.pdf?src-supplier=RSComponents; ComponentLink2URL: https://datasheet.ciiva.com/7941/444164-7941804.pdf?src-supplier=Element14; ComponentLink2Description: https://datasheet.ciiva.com/7941/444164-7941804.pdf?src-supplier=Element14; ComponentLink3URL: https://datasheet.ciiva.com/7941/1686128-7941805.pdf?src-supplier=Element14; ComponentLink3Description: https://datasheet.ciiva.com/7941/1686128-7941805.pdf?src-supplier=Element14; ComponentLink4URL: https://datasheet.ciiva.com/7941/444164-7941806.pdf?src-supplier=Element14; ComponentLink4Description: https://datasheet.ciiva.com/7941/444164-7941806.pdf?src-supplier=Element14; ComponentLink5URL: https://datasheet.ciiva.com/6547/pyu-r-int-thick-7-6547263.pdf?src-supplier=Digi-Key; ComponentLink5Description: https://datasheet.ciiva.com/6547/pyu-r-int-thick-7-6547263.pdf?src-supplier=Digi-Key; ComponentLink6URL: https://datasheet.ciiva.com/46447/444164-46447583.pdf?src-supplier=Element14; ComponentLink6Description: https://datasheet.ciiva.com/46447/444164-46447583.pdf?src-supplier=Element14; Supplier Part Number 1: 311-4.70KCRCT-ND
R5 = RC0805FR-07100RL: Resistor; Manufacturer_Name: YAGEO (PHYCOMP); Manufacturer: Yageo; Tolerance: 1%; Temperature Coefficient: 100ppm/°C; Voltage Rating (DC): 150V; Power Rating: 125mW; Application(s): HIGH RELIABILITY; Datasheet Link: http://www.yageo.com/documents/recent/PYu-RC_Group_51_RoHS_L_10.pdf; Height: 0.6mm; Manufacturer_Part_Number: RC0805FR-07100RL; Mouser Part Number: 603-RC0805FR-07100RL; Mouser Price/Stock: https://www.mouser.co.uk/ProductDetail/Yageo/RC0805FR-07100RL?qs=8Y8p%252BasKcI6MtXUgG4E6SQ%3D%3D; Arrow Part Number: RC0805FR-07100RL; Arrow Price/Stock: https://www.arrow.com/en/products/rc0805fr-07100rl/yageo; Supplier 1: Digi-Key; Manufacturer Part Number: RC0805FR-07100RL; Stock 1: 3240557; Pricing 1: 1=0.10000, 10=0.04000, 100=0.01620, 1000=0.00726, 2500=0.00630 (USD); RoHS: Yes; Case/Package: 0805; Number of Pins: 2; Case Code (Imperial): 0805; Case Code (Metric): 2012; Weight: 0.000917oz; Min Operating Temperature: -55°C; Max Operating Temperature: 155°C; Resistor Type: Thick Film; Packaging: Cut Tape; Voltage Rating: 150V; Package Quantity: 5000; Termination: SMD/SMT; Number of Terminations: 2; Max Power Dissipation: 125mW; Features: Moisture Resistant; Type: General Purpose; Series: RC; Technology: THICK FILM; Length: 2mm; Width: 1.25mm; Depth: 1.25mm; Lead Pitch: 0.4mm; REACH SVHC: Unknown; Lead Free: Lead Free; Military Standard: Not; RoHS Compliant: Yes; ComponentLink1URL: https://datasheet.ciiva.com/7941/1697719-7941680.pdf?src-supplier=Element14; ComponentLink1Description: https://datasheet.ciiva.com/7941/1697719-7941680.pdf?src-supplier=Element14; ComponentLink2URL: https://datasheet.ciiva.com/11808/0900766b8106beab-11808877.pdf?src-supplier=RSComponents; ComponentLink2Description: https://datasheet.ciiva.com/11808/0900766b8106beab-11808877.pdf?src-supplier=RSComponents; ComponentLink3URL: https://datasheet.ciiva.com/17082/rc0805-17082697.pdf?src-supplier=Future+Electronics; ComponentLink3Description: https://datasheet.ciiva.com/17082/rc0805-17082697.pdf?src-supplier=Future+Electronics; ComponentLink4URL: https://datasheet.ciiva.com/2456/pyu-r-int-thick-7-2456989.pdf?src-supplier=Digi-Key; ComponentLink4Description: https://datasheet.ciiva.com/2456/pyu-r-int-thick-7-2456989.pdf?src-supplier=Digi-Key; ComponentLink5URL: https://datasheet.ciiva.com/7660/38627-7660797.pdf?src-supplier=Element14; ComponentLink5Description: https://datasheet.ciiva.com/7660/38627-7660797.pdf?src-supplier=Element14; ComponentLink6URL: https://datasheet.ciiva.com/7941/1686128-7941679.pdf?src-supplier=Element14; ComponentLink6Description: https://datasheet.ciiva.com/7941/1686128-7941679.pdf?src-supplier=Element14; ComponentLink7URL: https://datasheet.ciiva.com/22747/444164-22747535.pdf?src-supplier=Element14; ComponentLink7Description: https://datasheet.ciiva.com/22747/444164-22747535.pdf?src-supplier=Element14; ComponentLink8URL: https://datasheet.ciiva.com/46447/444164-46447562.pdf?src-supplier=Element14; ComponentLink8Description: https://datasheet.ciiva.com/46447/444164-46447562.pdf?src-supplier=Element14; ComponentLink9URL: https://datasheet.ciiva.com/2456/pyu-r-int-thick-7-2456987.pdf?src-supplier=Digi-Key; ComponentLink9Description: https://datasheet.ciiva.com/2456/pyu-r-int-thick-7-2456987.pdf?src-supplier=Digi-Key; ComponentLink10URL: https://datasheet.ciiva.com/2456/pyu-r-int-thick-7-2456988.pdf?src-supplier=Digi-Key; ComponentLink10Description: https://datasheet.ciiva.com/2456/pyu-r-int-thick-7-2456988.pdf?src-supplier=Digi-Key; Supplier Part Number 1: 311-100CRCT-ND
R6 R10 = RT0805FRE0710KL: Resistor; Manufacturer_Name: YAGEO (PHYCOMP); Manufacturer: Yageo; Power Rating: 125mW; Tolerance: 1%; Voltage Rating: 150V; Temperature Coefficient: 50ppm/°C; Datasheet Link: https://www.yageo.com/upload/media/product/productsearch/datasheet/rchip/PYu-RT_1-to-0.01_RoHS_L_11.pdf; Height: 0.6mm; Manufacturer_Part_Number: RT0805FRE0710KL; Mouser Part Number: 603-RT0805FRE0710KL; Mouser Price/Stock: https://www.mouser.co.uk/ProductDetail/Yageo/RT0805FRE0710KL/?qs=Fz%2FrpjPuTcHcdP0eDiVtNg%3D%3D; Arrow Part Number: RT0805FRE0710KL; Arrow Price/Stock: https://www.arrow.com/en/products/rt0805fre-0710kl/yageo; Supplier 1: Digi-Key; Manufacturer Part Number: RT0805FRE0710KL; Stock 1: 3351; Pricing 1: 1=0.10000, 10=0.08000, 100=0.03100, 1000=0.01362, 2500=0.01176 (USD); RoHS: Yes; Case/Package: 0805; Case Code (Imperial): 0805; Case Code (Metric): 2012; Min Operating Temperature: -55°C; Max Operating Temperature: 125°C; Packaging: Tape and Reel; Package Quantity: 5000; Resistor Type: Thin Film; Termination: SMD/SMT; Number of Terminations: 2; Max Power Dissipation: 125mW; Voltage Rating (DC): 150V; Working Voltage: 150V; Length: 2mm; Width: 1.25mm; Depth: 1.25mm; REACH SVHC: Unknown; Military Standard: Not; Lead Free: Lead Free; RoHS Compliant: Yes; ComponentLink1URL: https://datasheet.ciiva.com/7942/1392914-7942072.pdf?src-supplier=Element14; ComponentLink1Description: https://datasheet.ciiva.com/7942/1392914-7942072.pdf?src-supplier=Element14; ComponentLink2URL: https://datasheet.ciiva.com/25647/pyu-rt-1-to-0-05-rohs-l-4-25647309.pdf?src-supplier=Digi-Key; ComponentLink2Description: https://datasheet.ciiva.com/25647/pyu-rt-1-to-0-05-rohs-l-4-25647309.pdf?src-supplier=Digi-Key; ComponentLink3URL: https://datasheet.ciiva.com/29711/pyu-rt-1-to-0-05-rohs-l-4-29711645.pdf?src-supplier=Digi-Key; ComponentLink3Description: https://datasheet.ciiva.com/29711/pyu-rt-1-to-0-05-rohs-l-4-29711645.pdf?src-supplier=Digi-Key; ComponentLink4URL: https://datasheet.ciiva.com/7942/1392914-7942071.pdf?src-supplier=Element14; ComponentLink4Description: https://datasheet.ciiva.com/7942/1392914-7942071.pdf?src-supplier=Element14; ComponentLink5URL: https://datasheet.ciiva.com/12834/pyu-rt-1-to-0-05-rohs-l-4-12834887.pdf?src-supplier=Mouser; ComponentLink5Description: https://datasheet.ciiva.com/12834/pyu-rt-1-to-0-05-rohs-l-4-12834887.pdf?src-supplier=Mouser; ComponentLink6URL: https://datasheet.ciiva.com/29711/pyu-rt-1-to-0-05-rohs-l-4-29711644.pdf?src-supplier=Digi-Key; ComponentLink6Description: https://datasheet.ciiva.com/29711/pyu-rt-1-to-0-05-rohs-l-4-29711644.pdf?src-supplier=Digi-Key; Supplier Part Number 1: YAG1239CT-ND
R7 = RC0805FR-07100KL: Resistor; Manufacturer_Name: YAGEO (PHYCOMP); Manufacturer: Yageo; Tolerance: 1%; Temperature Coefficient: 100ppm/°C; Power Rating: 125mW; Voltage Rating (DC): 150V; Datasheet Link: http://www.yageo.com/documents/recent/PYu-RC_Group_51_RoHS_L_10.pdf; Height: 0.6mm; Manufacturer_Part_Number: RC0805FR-07100KL; Mouser Part Number: 603-RC0805FR-07100KL; Mouser Price/Stock: https://www.mouser.co.uk/ProductDetail/Yageo/RC0805FR-07100KL/?qs=8Y8p%252BasKcI7rEWn6FcVdAA%3D%3D; Arrow Part Number: RC0805FR-07100KL; Arrow Price/Stock: https://www.arrow.com/en/products/rc0805fr-07100kl/yageo; Supplier 1: Digi-Key; Manufacturer Part Number: RC0805FR-07100KL; Stock 1: 1459559; Pricing 1: 1=0.10000, 10=0.04000, 100=0.01620, 1000=0.00726, 2500=0.00630 (USD); RoHS: Yes; Case/Package: 0805; Number of Pins: 2; Case Code (Metric): 2012; Case Code (Imperial): 0805; Size Code: 0805; Min Operating Temperature: -55°C; Max Operating Temperature: 155°C; Resistor Type: Thick Film; Packaging: Tape and Reel; Voltage Rating: 150V; Package Quantity: 1; Number of Terminations: 2; Termination: SMD/SMT; Max Power Dissipation: 125mW; Features: Moisture Resistant; Series: RC; Construction: Rectangular; Resistance Tolerance: 1%; Technology: THICK FILM; Length: 2mm; Width: 0.049inch; Depth: 1.25mm; Lead Pitch: 0.4mm; REACH SVHC: Unknown; Lead Free: Lead Free; RoHS Compliant: Yes; Military Standard: Not; ComponentLink1URL: https://datasheet.ciiva.com/11808/0900766b8106beab-11808858.pdf?src-supplier=RSComponents; ComponentLink1Description: https://datasheet.ciiva.com/11808/0900766b8106beab-11808858.pdf?src-supplier=RSComponents; ComponentLink2URL: https://datasheet.ciiva.com/2457/pyu-r-int-thick-7-2457017.pdf?src-supplier=Digi-Key; ComponentLink2Description: https://datasheet.ciiva.com/2457/pyu-r-int-thick-7-2457017.pdf?src-supplier=Digi-Key; ComponentLink3URL: https://datasheet.ciiva.com/12667/rc0805-12667001.pdf?src-supplier=Mouser; ComponentLink3Description: https://datasheet.ciiva.com/12667/rc0805-12667001.pdf?src-supplier=Mouser; ComponentLink4URL: https://datasheet.ciiva.com/2457/pyu-r-int-thick-7-2457018.pdf?src-supplier=Digi-Key; ComponentLink4Description: https://datasheet.ciiva.com/2457/pyu-r-int-thick-7-2457018.pdf?src-supplier=Digi-Key; ComponentLink5URL: https://datasheet.ciiva.com/16747/rc0805-16747226.pdf?src-supplier=Future+Electronics; ComponentLink5Description: https://datasheet.ciiva.com/16747/rc0805-16747226.pdf?src-supplier=Future+Electronics; ComponentLink6URL: https://datasheet.ciiva.com/2457/pyu-r-int-thick-7-2457019.pdf?src-supplier=Digi-Key; ComponentLink6Description: https://datasheet.ciiva.com/2457/pyu-r-int-thick-7-2457019.pdf?src-supplier=Digi-Key; ComponentLink7URL: https://datasheet.ciiva.com/7660/38627-7660796.pdf?src-supplier=Element14; ComponentLink7Description: https://datasheet.ciiva.com/7660/38627-7660796.pdf?src-supplier=Element14; ComponentLink8URL: https://datasheet.ciiva.com/7941/1697719-7941676.pdf?src-supplier=Element14; ComponentLink8Description: https://datasheet.ciiva.com/7941/1697719-7941676.pdf?src-supplier=Element14; ComponentLink9URL: https://datasheet.ciiva.com/7941/1686128-7941677.pdf?src-supplier=Element14; ComponentLink9Description: https://datasheet.ciiva.com/7941/1686128-7941677.pdf?src-supplier=Element14; ComponentLink10URL: https://datasheet.ciiva.com/7941/1697719-7941678.pdf?src-supplier=Element14; ComponentLink10Description: https://datasheet.ciiva.com/7941/1697719-7941678.pdf?src-supplier=Element14; ComponentLink11URL: https://datasheet.ciiva.com/22747/444164-22747534.pdf?src-supplier=Element14; ComponentLink11Description: https://datasheet.ciiva.com/22747/444164-22747534.pdf?src-supplier=Element14; Supplier Part Number 1: 311-100KCRCT-ND
R9 = RT0805FRE0747KL: Resistor; Manufacturer_Name: YAGEO (PHYCOMP); Manufacturer: Yageo; Power Rating: 125mW; Tolerance: 1%; Voltage Rating: 150V; Temperature Coefficient: 50ppm/°C; Datasheet Link: https://componentsearchengine.com/Datasheets/1/RT0805FRE0747KL.pdf; Height: 0.6mm; Manufacturer_Part_Number: RT0805FRE0747KL; Mouser Part Number: 603-RT0805FRE0747KL; Mouser Price/Stock: https://www.mouser.com/Search/Refine.aspx?Keyword=603-RT0805FRE0747KL; Supplier 1: Digi-Key; Manufacturer Part Number: RT0805FRE0747KL; Stock 1: 24446; Pricing 1: 1=0.10000, 10=0.08000, 100=0.03100, 1000=0.01362, 2500=0.01176 (USD); RoHS: Yes; Case/Package: 0805; Number of Pins: 2; Case Code (Metric): 2012; Case Code (Imperial): 0805; Min Operating Temperature: -55°C; Max Operating Temperature: 125°C; Packaging: Tape and Reel; Resistor Type: Thin Film; Termination: SMD/SMT; Package Quantity: 5000; Number of Terminations: 2; Max Power Dissipation: 125mW; Voltage Rating (DC): 150V; Features: Moisture Resistant; Series: RT; Resistance Tolerance: 1%; Construction: Rectangular; Length: 0.079inch; Width: 0.049inch; Depth: 1.25mm; REACH SVHC: No SVHC; Military Standard: Not; Lead Free: Lead Free; RoHS Compliant: Yes; ComponentLink1URL: https://datasheet.ciiva.com/7942/1392914-7942152.pdf?src-supplier=Element14; ComponentLink1Description: https://datasheet.ciiva.com/7942/1392914-7942152.pdf?src-supplier=Element14; ComponentLink2URL: https://datasheet.ciiva.com/7942/1392914-7942153.pdf?src-supplier=Element14; ComponentLink2Description: https://datasheet.ciiva.com/7942/1392914-7942153.pdf?src-supplier=Element14; ComponentLink3URL: https://datasheet.ciiva.com/5990/1392914-5990606.pdf?src-supplier=Farnell; ComponentLink3Description: https://datasheet.ciiva.com/5990/1392914-5990606.pdf?src-supplier=Farnell; Supplier Part Number 1: YAG3363CT-ND